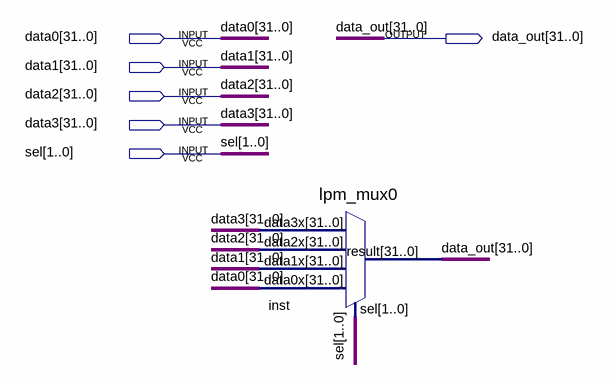
[diagram p0: schematic sheet]
// Quartus schematic data_mux_4to1.bdf as structural Verilog: 1 symbols, 6 pins
module data_mux_4to1 (
  input  [31:0] data0,
  input  [31:0] data1,
  input  [31:0] data2,
  input  [31:0] data3,
  input  [1:0] sel,
  output [31:0] data_out
);

  lpm_mux0 inst (.data3x(data3), .data2x(data2), .data1x(data1), .data0x(data0), .sel(sel), .result(data_out));
endmodule
